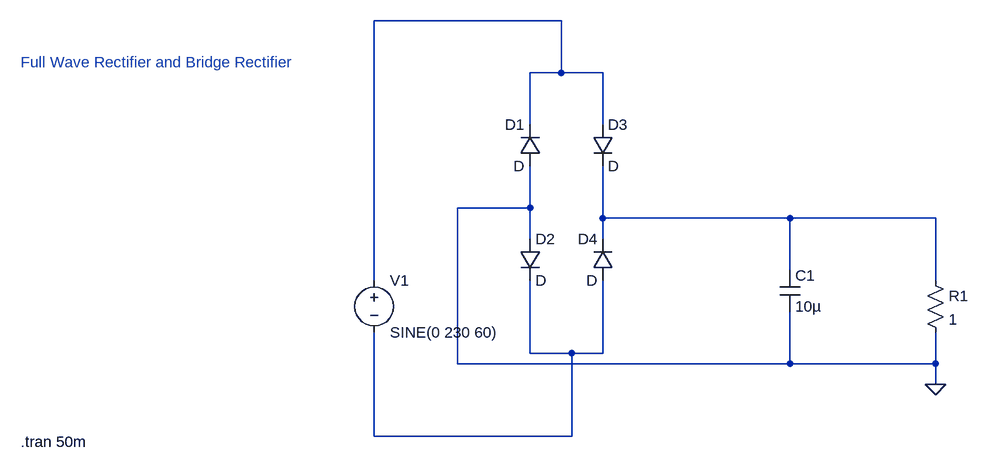
[diagram p0: schematic 2HalfRectifire.asc]
2HalfRectifire.asc, the LTspice schematic file:
Version 4.1
SHEET 1 904 680
WIRE 272 -176 -16 -176
WIRE 272 -96 272 -176
WIRE 272 -96 224 -96
WIRE 336 -96 272 -96
WIRE 224 -16 224 -96
WIRE 336 -16 336 -96
WIRE 224 112 224 48
WIRE 224 112 112 112
WIRE 336 128 336 48
WIRE 624 128 336 128
WIRE 848 128 624 128
WIRE 224 160 224 112
WIRE 336 160 336 128
WIRE 624 208 624 128
WIRE -16 224 -16 -176
WIRE 848 224 848 128
WIRE 224 336 224 224
WIRE 288 336 224 336
WIRE 336 336 336 224
WIRE 336 336 288 336
WIRE 112 352 112 112
WIRE 624 352 624 272
WIRE 624 352 112 352
WIRE 848 352 848 304
WIRE 848 352 624 352
WIRE 848 384 848 352
WIRE -16 464 -16 304
WIRE 288 464 288 336
WIRE 288 464 -16 464
FLAG 848 384 0
SYMBOL res 832 208 R0
SYMATTR InstName R1
SYMATTR Value 1
SYMBOL cap 608 208 R0
SYMATTR InstName C1
SYMATTR Value 10µ
SYMBOL voltage -16 208 R0
WINDOW 123 0 0 Left 0
WINDOW 39 0 0 Left 0
SYMATTR InstName V1
SYMATTR Value SINE(0 230 60)
SYMBOL diode 240 48 R180
WINDOW 0 24 64 Left 2
WINDOW 3 24 0 Left 2
SYMATTR InstName D1
SYMBOL diode 208 160 R0
SYMATTR InstName D2
SYMBOL diode 320 -16 R0
SYMATTR InstName D3
SYMBOL diode 352 224 R180
WINDOW 0 24 64 Left 2
WINDOW 3 24 0 Left 2
SYMATTR InstName D4
TEXT -560 -112 Left 2 ;Full Wave Rectifier and Bridge Rectifier
TEXT -560 472 Left 2 !.tran 50m

The netlist it stands for:
* 2HalfRectifire.asc
R1 N002 0 1
C1 N002 0 10µ
V1 N001 N003 SINE(0 230 60)
D1 0 N001 D
D2 0 N003 D
D3 N001 N002 D
D4 N003 N002 D
.model D D
.lib standard.dio
* Full Wave Rectifier and Bridge Rectifier
.tran 50m
.backanno
.end